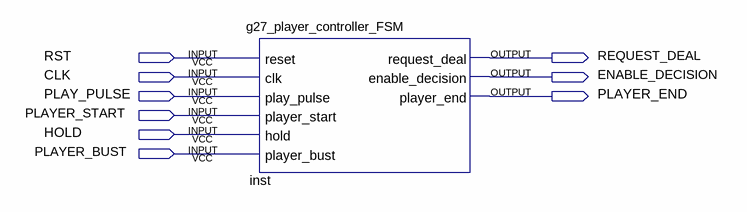
[diagram p0: schematic sheet]
// Quartus schematic g27_player_controller_schematic.bdf as structural Verilog: 1 symbols, 9 pins
module g27_player_controller_schematic (
  input  RST,
  input  CLK,
  input  PLAY_PULSE,
  input  PLAYER_START,
  input  HOLD,
  input  PLAYER_BUST,
  output REQUEST_DEAL,
  output ENABLE_DECISION,
  output PLAYER_END
);

  g27_player_controller_FSM inst (
    .reset(RST), .clk(CLK), .play_pulse(PLAY_PULSE), .player_start(PLAYER_START), .hold(HOLD),
    .player_bust(PLAYER_BUST), .request_deal(REQUEST_DEAL), .enable_decision(ENABLE_DECISION),
    .player_end(PLAYER_END));
endmodule
